# Altium project span-ion-cfd-respin.PrjPcb (part 2 of 2)
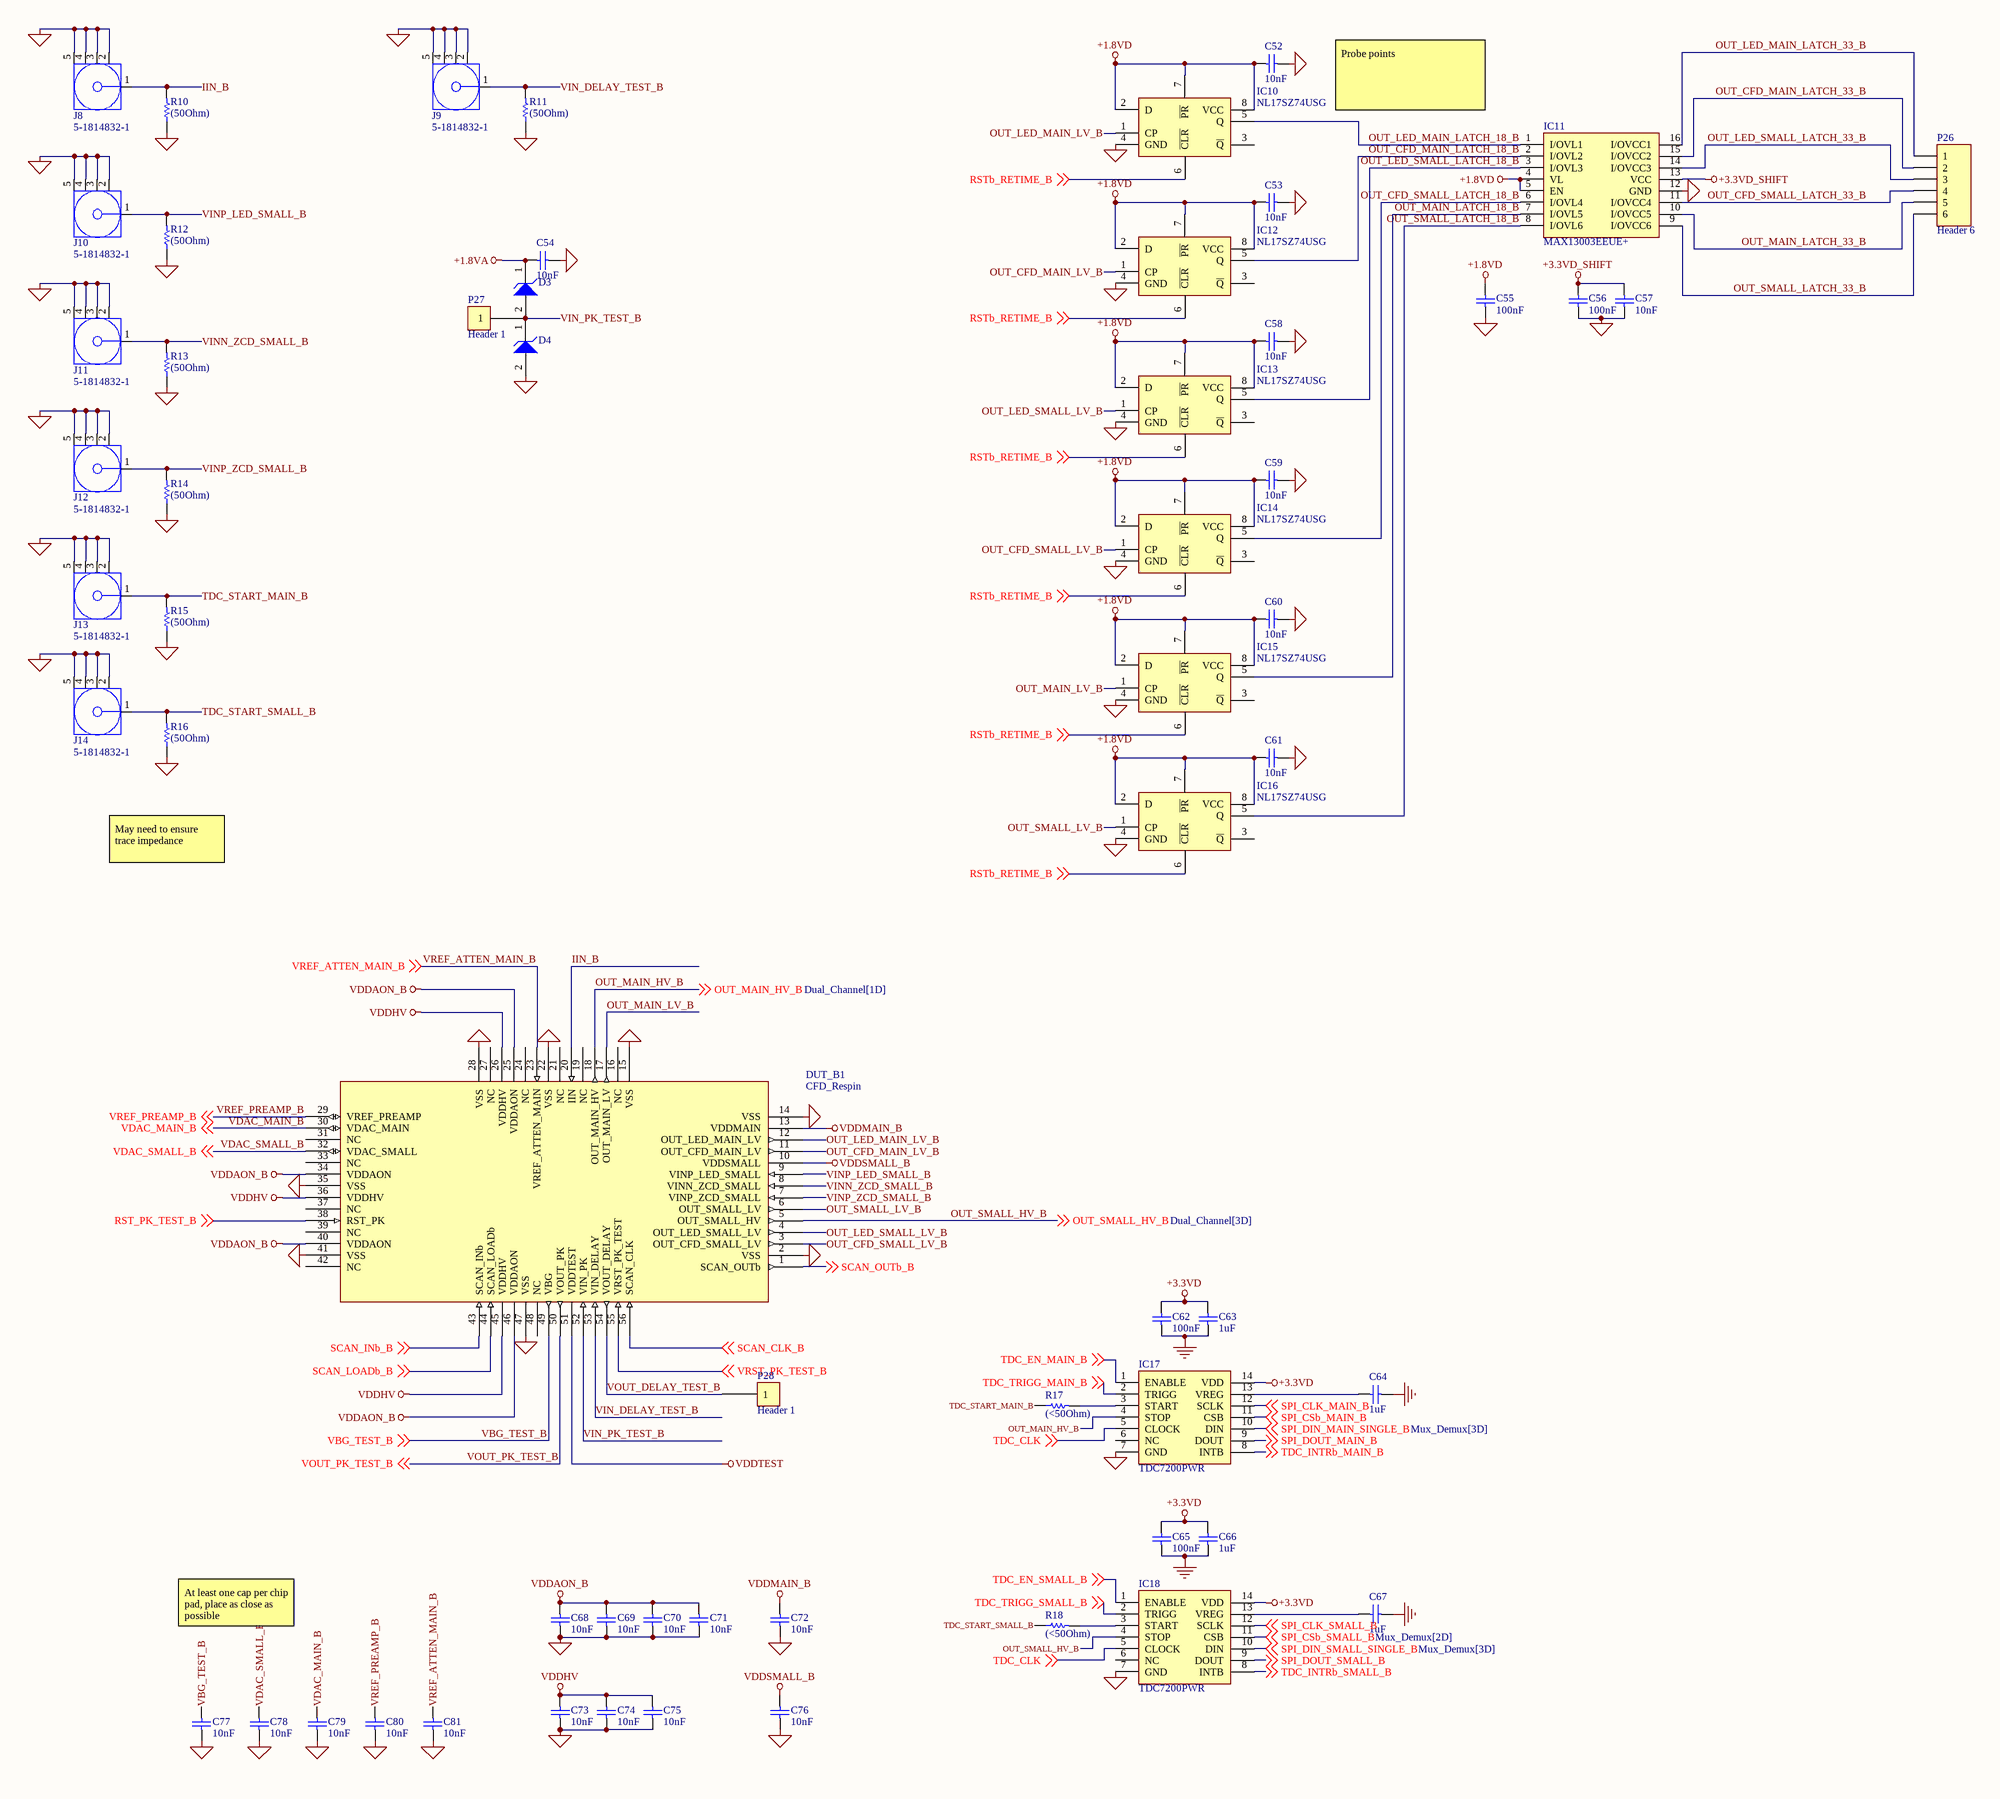
[diagram p6: Channel_B.SchDoc]

## Nets that join several sheets
+1.8VA: Power (C2.1 P4.2 U1.5), Channel_A (C24.2 D1.1), Channel_B (C54.2 D3.1)
+1.8VD: Power (C4.1 P5.2 U2.5), Mux_Demux (12 pins), Channel_A (27 pins), Channel_B (27 pins)
+1.8VD_SHIFT: Power (C6.1 P6.2 U3.5), Teensy_Interface (C84.1 IC19.4 IC19.5)
+3.3VD: Power (C3.1 P2.2 U2.1 U2.3), Mux_Demux (34 pins), Dual_Channel (6 pins), Channel_A (6 pins), Channel_B (6 pins)
+3.3VD_SHIFT: Power (C5.1 P3.2 U3.1 U3.3), Teensy_Interface (C82.2 C83.2 IC19.13), Channel_A (C26.2 C27.2 IC2.13), Channel_B (C56.2 C57.2 IC11.13)
GND: Power (32 pins), Teensy_Interface (10 pins), Mux_Demux (68 pins), Dual_Channel (8 pins), Channel_A (83 pins), Channel_B (83 pins)
VDDAON_A: Power (P19.2 P20.1), Teensy_Interface (P31.2), Channel_A (8 pins)
VDDAON_B: Power (P17.2 P18.1), Teensy_Interface (P34.2), Channel_B (8 pins)
VDDHV: Power (P7.2), Channel_A (6 pins), Channel_B (6 pins)
VDDMAIN_A: Power (P12.2 P13.1), Teensy_Interface (P37.2), Channel_A (C42.2 DUT_A1.13)
VDDMAIN_B: Power (P8.2 P9.1), Teensy_Interface (P40.2), Channel_B (C72.2 DUT_B1.13)
VDDSMALL_A: Power (P14.2 P15.1), Teensy_Interface (P42.2), Channel_A (C46.2 DUT_A1.10)
VDDSMALL_B: Power (P10.2 P11.1), Teensy_Interface (P46.2), Channel_B (C76.2 DUT_B1.10)
VDDTEST: Power (P21.2 P22.1), Channel_A (DUT_A1.51), Channel_B (DUT_B1.51)
OUT_MAIN_HV_A: Dual_Channel (IC20.3), Channel_A (DUT_A1.18 IC8.4)
OUT_MAIN_HV_B: Dual_Channel (IC20.4), Channel_B (DUT_B1.18 IC17.4)
OUT_SMALL_HV_A: Dual_Channel (IC21.3), Channel_A (DUT_A1.5 IC9.4)
OUT_SMALL_HV_B: Dual_Channel (IC21.4), Channel_B (DUT_B1.5 IC18.4)
RST_PK_TEST_A: Teensy_Interface (IC19.8), Channel_A (DUT_A1.38), Channel_B (DUT_B1.38)
RSTb_RETIME: Teensy_Interface (P43.16 TEENSY1.24), Mux_Demux (IC39.3)
RSTb_RETIME_A: Mux_Demux (IC39.6), Channel_A (6 pins)
RSTb_RETIME_B: Mux_Demux (IC39.4), Channel_B (6 pins)
SCAN_CLK_A: Mux_Demux (IC36.2), Channel_A (DUT_A1.56)
SCAN_CLK_B: Mux_Demux (IC36.4), Channel_B (DUT_B1.56)
SCAN_CLKb: Teensy_Interface (IC19.3), Mux_Demux (IC38.3)
SCAN_INb_A: Teensy_Interface (IC19.7), Channel_A (DUT_A1.43), Channel_B (DUT_B1.43)
SCAN_LOADb: Teensy_Interface (IC19.6), Mux_Demux (IC35.3)
SCAN_LOADb_A: Mux_Demux (IC35.6), Channel_A (DUT_A1.44)
SCAN_LOADb_B: Mux_Demux (IC35.4), Channel_B (DUT_B1.44)
SCAN_OUTb: Teensy_Interface (IC19.2), Mux_Demux (IC42.7)
SCAN_OUTb_A: Mux_Demux (IC42.5 IC42.6), Channel_A (DUT_A1.1)
SCAN_OUTb_B: Mux_Demux (IC42.3 IC42.4), Channel_B (DUT_B1.1)
SPI_CLK_MAIN_A: Mux_Demux (IC30.2), Channel_A (IC8.12)
SPI_CLK_MAIN_B: Mux_Demux (IC30.4), Channel_B (IC17.12)
SPI_CLK_MAIN_DUAL: Mux_Demux (IC26.2), Dual_Channel (IC20.12)
SPI_CLK_SMALL_A: Mux_Demux (IC30.6), Channel_A (IC9.12)
SPI_CLK_SMALL_B: Mux_Demux (IC30.8), Channel_B (IC18.12)
SPI_CLK_SMALL_DUAL: Mux_Demux (IC26.4), Dual_Channel (IC21.12)
SPI_CLKb_DUAL: Teensy_Interface (P43.7 TEENSY1.5), Mux_Demux (IC25.3)
SPI_CLKb_SINGLE: Teensy_Interface (P43.8 TEENSY1.6), Mux_Demux (IC40.3)
SPI_CSb_DUAL: Teensy_Interface (P43.9 TEENSY1.7), Mux_Demux (IC27.3)
SPI_CSb_MAIN_A: Mux_Demux (IC29.6), Channel_A (IC8.11)
SPI_CSb_MAIN_B: Mux_Demux (IC29.4), Channel_B (IC17.11)
SPI_CSb_MAIN_DUAL: Mux_Demux (IC27.6), Dual_Channel (IC20.11)
SPI_CSb_SINGLE: Teensy_Interface (P43.10 TEENSY1.8), Mux_Demux (IC28.3)
SPI_CSb_SMALL_A: Mux_Demux (IC31.6), Channel_A (IC9.11)
SPI_CSb_SMALL_B: Mux_Demux (IC31.4), Channel_B (IC18.11)
SPI_CSb_SMALL_DUAL: Mux_Demux (IC27.4), Dual_Channel (IC21.11)
SPI_DIN: Teensy_Interface (TEENSY1.32/A13), Mux_Demux (6 pins)
SPI_DIN_MAIN_DUAL: Mux_Demux (R19.1), Dual_Channel (IC20.10)
SPI_DIN_MAIN_SINGLE_A: Mux_Demux (R21.1), Channel_A (IC8.10)
SPI_DIN_MAIN_SINGLE_B: Mux_Demux (R22.1), Channel_B (IC17.10)
SPI_DIN_SMALL_DUAL: Mux_Demux (R20.1), Dual_Channel (IC21.10)
SPI_DIN_SMALL_SINGLE_A: Mux_Demux (R23.1), Channel_A (IC9.10)
SPI_DIN_SMALL_SINGLE_B: Mux_Demux (R24.1), Channel_B (IC18.10)
SPI_DOUT_DUAL: Teensy_Interface (P43.11 TEENSY1.9/CS), Mux_Demux (IC24.7)
SPI_DOUT_MAIN_A: Mux_Demux (IC22.10), Channel_A (IC8.9)
SPI_DOUT_MAIN_B: Mux_Demux (IC22.12), Channel_B (IC17.9)
SPI_DOUT_MAIN_DUAL: Mux_Demux (IC24.4 IC24.6), Dual_Channel (IC20.9)
SPI_DOUT_SINGLE: Teensy_Interface (P43.12 TEENSY1.10/CS), Mux_Demux (IC22.9)
SPI_DOUT_SMALL_A: Mux_Demux (IC22.11), Channel_A (IC9.9)
SPI_DOUT_SMALL_B: Mux_Demux (IC22.13), Channel_B (IC18.9)
SPI_DOUT_SMALL_DUAL: Mux_Demux (IC24.3 IC24.5), Dual_Channel (IC21.9)
TDC_CLK: Teensy_Interface (TEENSY1.31/A12), Dual_Channel (IC20.5 IC21.5), Channel_A (IC8.5 IC9.5), Channel_B (IC17.5 IC18.5)
TDC_EN_MAIN_A: Mux_Demux (IC32.6), Channel_A (IC8.1)
TDC_EN_MAIN_B: Mux_Demux (IC32.8), Channel_B (IC17.1)
TDC_EN_MAIN_DUAL: Mux_Demux (IC30.10), Dual_Channel (IC20.1)
TDC_EN_SMALL_A: Mux_Demux (IC32.10), Channel_A (IC9.1)
TDC_EN_SMALL_B: Mux_Demux (IC32.12), Channel_B (IC18.1)
TDC_EN_SMALL_DUAL: Mux_Demux (IC30.12), Dual_Channel (IC21.1)
TDC_ENb_DUAL: Teensy_Interface (P43.13 TEENSY1.11/MOSI), Mux_Demux (IC44.3)
TDC_ENb_SINGLE: Teensy_Interface (P43.14 TEENSY1.12/MISO), Mux_Demux (IC33.3)
TDC_INTRb_DUAL: Teensy_Interface (P43.5 TEENSY1.3/CANTX), Mux_Demux (IC24.9)
TDC_INTRb_MAIN_A: Mux_Demux (IC23.6), Channel_A (IC8.8)
TDC_INTRb_MAIN_B: Mux_Demux (IC23.4), Channel_B (IC17.8)
TDC_INTRb_MAIN_DUAL: Mux_Demux (IC24.10 IC24.12), Dual_Channel (IC20.8)
TDC_INTRb_SINGLE: Teensy_Interface (P43.22 TEENSY1.30), Mux_Demux (IC23.7)
TDC_INTRb_SMALL_A: Mux_Demux (IC23.5), Channel_A (IC9.8)
TDC_INTRb_SMALL_B: Mux_Demux (IC23.3), Channel_B (IC18.8)
TDC_INTRb_SMALL_DUAL: Mux_Demux (IC24.11 IC24.13), Dual_Channel (IC21.8)
TDC_TRIGG_DUAL: Teensy_Interface (P43.6 TEENSY1.4/CANRX), Mux_Demux (IC23.9)
TDC_TRIGG_MAIN_A: Mux_Demux (IC22.6), Channel_A (IC8.2)
TDC_TRIGG_MAIN_B: Mux_Demux (IC22.4), Channel_B (IC17.2)
TDC_TRIGG_MAIN_DUAL: Mux_Demux (IC23.10 IC23.12), Dual_Channel (IC20.2)
TDC_TRIGG_SINGLE: Teensy_Interface (P43.4 TEENSY1.2), Mux_Demux (IC22.7)
TDC_TRIGG_SMALL_A: Mux_Demux (IC22.5), Channel_A (IC9.2)
TDC_TRIGG_SMALL_B: Mux_Demux (IC22.3), Channel_B (IC18.2)
TDC_TRIGG_SMALL_DUAL: Mux_Demux (IC23.11 IC23.13), Dual_Channel (IC21.2)
VBG_TEST_A: Teensy_Interface (P35.2), Channel_A (C47.2 DUT_A1.49)
VBG_TEST_B: Teensy_Interface (P38.2), Channel_B (C77.2 DUT_B1.49)
VDAC_MAIN_A: Teensy_Interface (P36.2), Channel_A (C49.2 DUT_A1.30)
VDAC_MAIN_B: Teensy_Interface (P39.2), Channel_B (C79.2 DUT_B1.30)
VDAC_SMALL_A: Teensy_Interface (P30.2), Channel_A (C48.2 DUT_A1.32)
VDAC_SMALL_B: Teensy_Interface (P33.2), Channel_B (C78.2 DUT_B1.32)
VOUT_PK_TEST_A: Teensy_Interface (P29.2), Channel_A (DUT_A1.50)
VOUT_PK_TEST_B: Teensy_Interface (P32.2), Channel_B (DUT_B1.50)
VREF_ATTEN_MAIN_A: Mux_Demux (P48.1), Channel_A (C51.2 DUT_A1.23)
VREF_ATTEN_MAIN_B: Mux_Demux (P48.2), Channel_B (C81.2 DUT_B1.23)
VREF_PREAMP_A: Teensy_Interface (P41.2), Channel_A (C50.2 DUT_A1.29)
VREF_PREAMP_B: Teensy_Interface (P45.2), Channel_B (C80.2 DUT_B1.29)
VRST_PK_TEST_A: Mux_Demux (P47.1), Channel_A (DUT_A1.55)
VRST_PK_TEST_B: Mux_Demux (P47.2), Channel_B (DUT_B1.55)